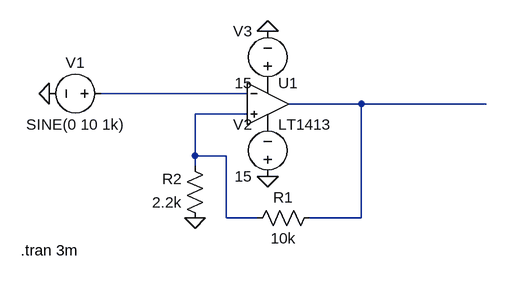
[diagram p0: schematic inv_schmitttriger.asc]
inv_schmitttriger.asc, the LTspice schematic file:
Version 4
SHEET 1 880 680
WIRE 240 144 16 144
WIRE 416 160 304 160
WIRE 608 160 416 160
WIRE 240 176 160 176
WIRE 160 240 160 176
WIRE 208 240 160 240
WIRE 160 256 160 240
WIRE 208 336 208 240
WIRE 256 336 208 336
WIRE 416 336 416 160
WIRE 416 336 336 336
FLAG -64 144 0
FLAG 160 336 0
FLAG 272 48 0
FLAG 272 272 0
SYMBOL OpAmps\\LT1413 272 96 R0
SYMATTR InstName U1
SYMBOL voltage 32 144 R90
WINDOW 0 -32 56 VBottom 2
WINDOW 3 32 56 VTop 2
WINDOW 123 0 0 Left 0
WINDOW 39 0 0 Left 0
SYMATTR InstName V1
SYMATTR Value SINE(0 10 1k)
SYMBOL voltage 272 288 R180
WINDOW 0 24 96 Left 2
WINDOW 3 24 16 Left 2
WINDOW 123 0 0 Left 0
WINDOW 39 0 0 Left 0
SYMATTR InstName V2
SYMATTR Value 15
SYMBOL voltage 272 144 R180
WINDOW 0 24 96 Left 2
WINDOW 3 24 16 Left 2
WINDOW 123 0 0 Left 0
WINDOW 39 0 0 Left 0
SYMATTR InstName V3
SYMATTR Value 15
SYMBOL res 352 320 R90
WINDOW 0 0 56 VBottom 2
WINDOW 3 32 56 VTop 2
SYMATTR InstName R1
SYMATTR Value 10k
SYMBOL res 176 352 R180
WINDOW 0 36 76 Left 2
WINDOW 3 36 40 Left 2
SYMATTR InstName R2
SYMATTR Value 2.2k
TEXT -108 386 Left 2 !.tran 3m

The netlist it stands for:
* inv_schmitttriger.asc
XU1 N003 N001 P001 P002 N002 LT1413  ; pins In+ In- V+ V- OUT
V1 N001 0 SINE(0 10 1k)
V2 0 P002 15
V3 P001 0 15
R1 N002 N003 10k
R2 0 N003 2.2k
.tran 3m
.lib LTC.lib
.backanno
.end